# Altium schematic sheet C210_0001_Serial_Interface.SchDoc: C210_0001_Serial_Interface
size B; Date: 2/26/2021; CompanyName: U-blox; DrawnBy: EMOO; Engineer: EMOO; Organization: U-blox; Address1: 2601 25th St. SE; Address2: Salem, OR 97302; SheetNumber: 1; SheetTotal: 7; Website: www.u-blox.com; SheetSize: B; SheetTitle: C-210 Serial Interface
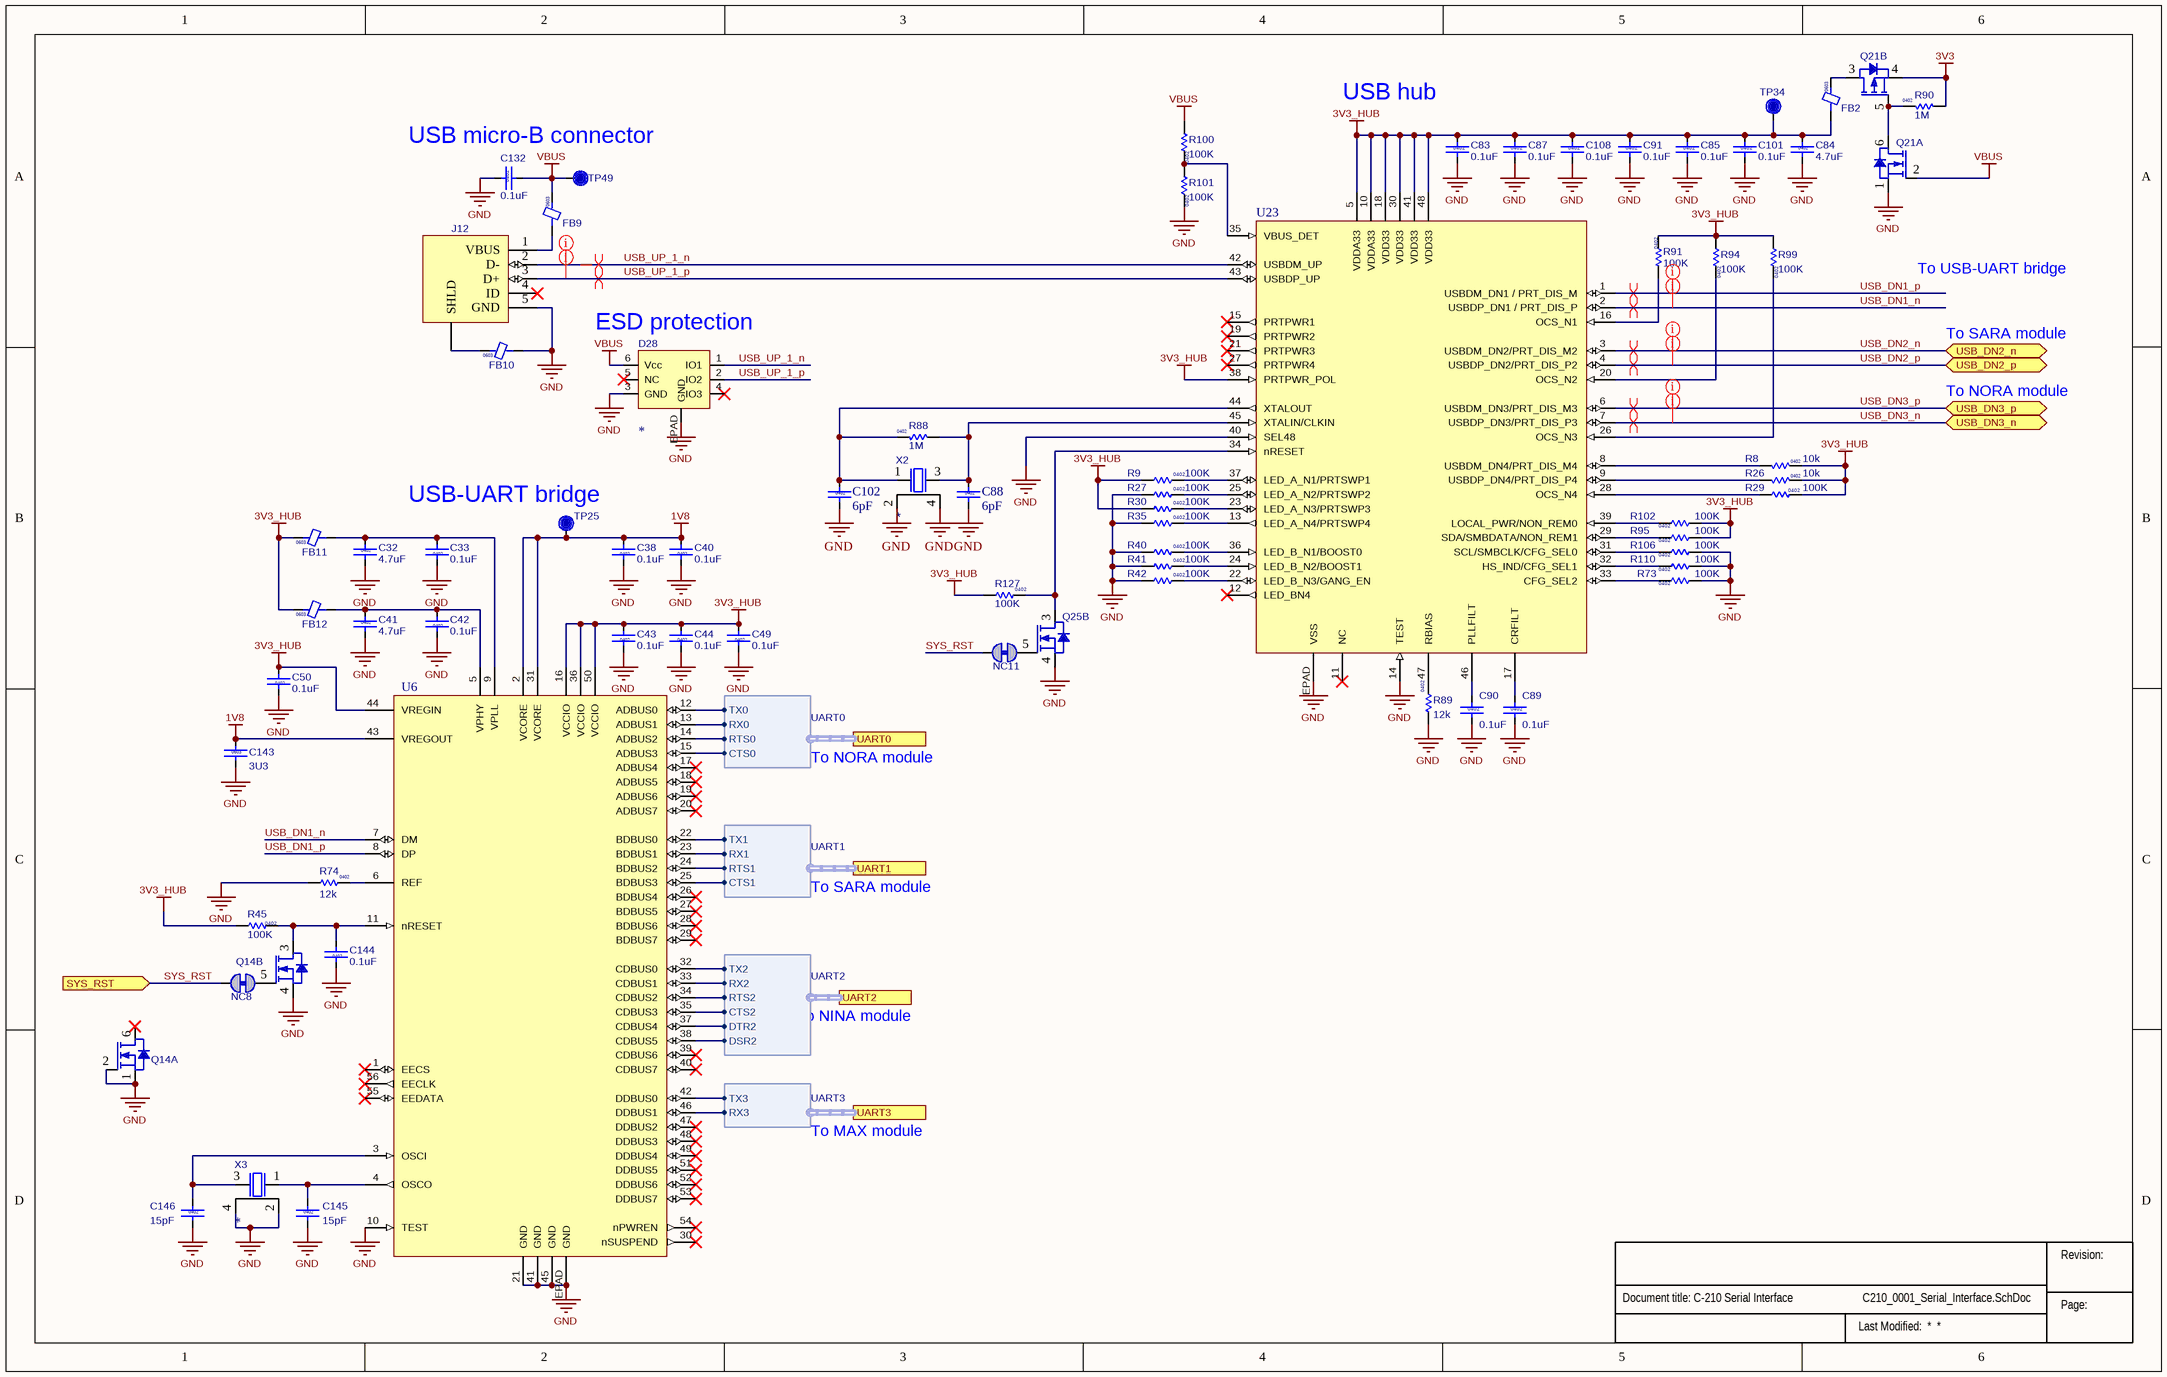
[diagram p0: C210_0001_Serial_Interface.SchDoc]

## Parts
?  (no value)  (graphical)
C32  value 4.7uF  Size: 0402  [Cap 0402 HD]
C33  value 0.1uF  Size: 0402  [Cap 0402 HD]  (hidden comment: 120-000160.1uF)
C38  value 0.1uF  Size: 0402  [Cap 0402 HD]  (hidden comment: 120-000160.1uF)
C40  value 0.1uF  Size: 0402  [Cap 0402 HD]  (hidden comment: 120-000160.1uF)
C41  value 4.7uF  Size: 0402  [Cap 0402 HD]
C42  value 0.1uF  Size: 0402  [Cap 0402 HD]  (hidden comment: 120-000160.1uF)
C43  value 0.1uF  Size: 0402  [Cap 0402 HD]  (hidden comment: 120-000160.1uF)
C44  value 0.1uF  Size: 0402  [Cap 0402 HD]  (hidden comment: 120-000160.1uF)
C49  value 0.1uF  Size: 0402  [Cap 0402 HD]  (hidden comment: 120-000160.1uF)
C50  value 0.1uF  Size: 0402  [Cap 0402 HD]  (hidden comment: 120-000160.1uF)
C83  value 0.1uF  Size: 0402  [Cap 0402 HD]  (hidden comment: 120-000160.1uF)
C84  value 4.7uF  Size: 0402  [Cap 0402 HD]
C85  value 0.1uF  Size: 0402  [Cap 0402 HD]  (hidden comment: 120-000160.1uF)
C87  value 0.1uF  Size: 0402  [Cap 0402 HD]  (hidden comment: 120-000160.1uF)
C88  value 6pF  Size: 0402  [Cap 0402 HD]
C89  value 0.1uF  Size: 0402  [Cap 0402 HD]  (hidden comment: 120-000160.1uF)
C90  value 0.1uF  Size: 0402  [Cap 0402 HD]  (hidden comment: 120-000160.1uF)
C91  value 0.1uF  Size: 0402  [Cap 0402 HD]  (hidden comment: 120-000160.1uF)
C101  value 0.1uF  Size: 0402  [Cap 0402 HD]  (hidden comment: 120-000160.1uF)
C102  value 6pF  Size: 0402  [Cap 0402 HD]
C108  value 0.1uF  Size: 0402  [Cap 0402 HD]  (hidden comment: 120-000160.1uF)
C132  value 0.1uF  Size: 0402  [Cap 0402 HD]  (hidden comment: 120-000160.1uF)
C143  value 3U3  Size: 0603  [Cap 0603 HD]
C144  value 0.1uF  Size: 0402  [Cap 0402 HD]  (hidden comment: 120-000160.1uF)
C145  value 15pF  Size: 0402  [Cap 0402 HD]
C146  value 15pF  Size: 0402  [Cap 0402 HD]
D28  (no value)  [TPD3E001DRSR]
FB2  Size: 0603  [BLM18EG221SN1]
FB9  Size: 0603  [BLM18EG221SN1]
FB10  Size: 0603  [BLM18EG221SN1]
FB11  Size: 0603  [BLM18EG221SN1]
FB12  Size: 0603  [BLM18EG221SN1]
J12  (no value)  [USB_Micro_RA_W-2TABS]
NC8  Solderbridge-ShortDNP  [Solderbridge-Short]  (value not drawn)  (net tie, no BOM)
NC11  Solderbridge-ShortDNP  [Solderbridge-Short]  (value not drawn)  (net tie, no BOM)
Q14  (no value)  [SOT-563]  (parts A,B of 2)
Q21  (no value)  [SOT-563]  (parts A,B of 2)
Q25  (no value)  [SOT-563]  (part B of 2)
R8  value 10k  Size: 0402  [RES 0402 HD]
R9  value 100K  Size: 0402  [RES 0402 HD]
R26  value 10k  Size: 0402  [RES 0402 HD]
R27  value 100K  Size: 0402  [RES 0402 HD]
R29  value 100K  Size: 0402  [RES 0402 HD]
R30  value 100K  Size: 0402  [RES 0402 HD]
R35  value 100K  Size: 0402  [RES 0402 HD]
R40  value 100K  Size: 0402  [RES 0402 HD]
R41  value 100K  Size: 0402  [RES 0402 HD]
R42  value 100K  Size: 0402  [RES 0402 HD]
R45  value 100K  Size: 0402  [RES 0402 HD]
R73  value 100K  Size: 0402  [RES 0402 HD]
R74  value 12k  Size: 0402  [RES 0402 HD]
R88  value 1M  Size: 0402  [RES 0402 HD]
R89  value 12k  Size: 0402  [RES 0402 HD]
R90  value 1M  Size: 0402  [RES 0402 HD]
R91  value 100K  Size: 0402  [RES 0402 HD]
R94  value 100K  Size: 0402  [RES 0402 HD]
R95  value 100K  Size: 0402  [RES 0402 HD]
R99  value 100K  Size: 0402  [RES 0402 HD]
R100  value 100K  Size: 0402  [RES 0402 HD]
R101  value 100K  Size: 0402  [RES 0402 HD]
R102  value 100K  Size: 0402  [RES 0402 HD]
R106  value 100K  Size: 0402  [RES 0402 HD]
R110  value 100K  Size: 0402  [RES 0402 HD]
R127  value 100K  Size: 0402  [RES 0402 HD]
TP25  TP  [TP12R]  (value not drawn)  (no BOM)
TP34  TP  [TP12R]  (value not drawn)  (no BOM)
TP49  TP  [TP12R]  (value not drawn)  (no BOM)
U6  (no value)  [QFN0.5P8.0x8.0-56Pin_EPAD]
U23  (no value)  [QFN0.5P7.0x7.0-48Pin_EPAD]
X2  (no value)  [XTAL_2520_HD]
X3  (no value)  [XTAL_2520]

## Ports
SYS_RST (in), UART0 (harness UART0), UART1 (harness UART1), UART2 (harness UART2), UART3 (harness UART3), USB_DN2_n (bidir), USB_DN2_p (bidir), USB_DN3_n (bidir), USB_DN3_p (bidir)

## Harnesses
UART0: TX0, RX0, RTS0, CTS0
UART1: TX1, RX1, RTS1, CTS1
UART2: TX2, RX2, RTS2, CTS2, DTR2, DSR2
UART3: TX3, RX3

## Nets
1V8: C38.2 C40.2 C143.1 TP25.1 U6.2(VCORE) U6.31(VCORE) U6.43(VREGOUT)
3V3: Q21.4(S2) R90.1
3V3_HUB: C43.2 C44.2 C49.2 C50.2 C83.1 C84.1 C85.1 C87.1 C91.1 C101.1 C108.1 FB2.1 FB11.2 FB12.2 R8.2 R9.1 R26.2 R29.2 R30.1 R45.1 R91.2 R94.1 R95.1 R99.1 R102.1 R127.1 TP34.1 U6.16(VCCIO) U6.36(VCCIO) U6.44(VREGIN) U6.50(VCCIO) U23.5(VDDA33) U23.10(VDDA33) U23.18(VDD33) U23.30(VDD33) U23.38(PRTPWR_POL) U23.41(VDD33) U23.48(VDD33)
GND: C32.2 C33.1 C38.1 C40.1 C41.2 C42.1 C43.1 C44.1 C49.1 C50.1 C83.2 C84.2 C85.2 C87.2 C88.2 C89.2 C90.2 C91.2 C101.2 C102.2 C108.2 C132.1 C143.2 C144.1 C145.2 C146.2 D28.3(GND) D28.EPAD(GND) FB10.1 J12.5(GND) Q14.1(S1) Q14.2(G1) Q14.4(S2) Q21.1(S1) Q25.4(S2) R27.1 R35.1 R40.1 R41.1 R42.1 R73.2 R74.1 R89.1 R101.2 R106.2 R110.2 U6.10(TEST) U6.21(GND) U6.41(GND) U6.45(GND) U6.EPAD(GND) U23.14(TEST) U23.40(SEL48) U23.EPAD(VSS) X2.2 X2.4 X3.2 X3.4
VBUS: C132.2 D28.6(Vcc) FB9.2 Q21.2(G1) R100.1 TP49.1
SYS_RST: NC8.2 NC11.2 ; port SYS_RST
USB_DN1_n: U6.7(DM) U23.2(USBDP_DN1_/_PRT_DIS_P)
USB_DN1_p: U6.8(DP) U23.1(USBDM_DN1_/_PRT_DIS_M)
USB_DN2_n: U23.3(USBDM_DN2/PRT_DIS_M2) ; port USB_DN2_n
USB_DN2_p: U23.4(USBDP_DN2/PRT_DIS_P2) ; port USB_DN2_p
USB_DN3_n: U23.7(USBDP_DN3/PRT_DIS_P3) ; port USB_DN3_n
USB_DN3_p: U23.6(USBDM_DN3/PRT_DIS_M3) ; port USB_DN3_p
USB_UP_1_n: D28.1(IO1) J12.2(D-) U23.42(USBDM_UP)
USB_UP_1_p: D28.2(IO2) J12.3(D+) U23.43(USBDP_UP)
NetC32_1: C32.1 C33.2 FB11.1 U6.9(VPLL)
NetC41_1: C41.1 C42.2 FB12.1 U6.5(VPHY)
NetC88_1: C88.1 R88.1 U23.45(XTALIN/CLKIN) X2.3
NetC89_1: C89.1 U23.17(CRFILT)
NetC90_1: C90.1 U23.46(PLLFILT)
NetC102_1: C102.1 R88.2 U23.44(XTALOUT) X2.1
NetC144_2: C144.2 Q14.3(D2) R45.2 U6.11(nRESET)
NetC145_1: C145.1 U6.4(OSCO) X3.1
NetC146_1: C146.1 U6.3(OSCI) X3.3
NetFB2_2: FB2.2 Q21.3(D2)
NetFB9_1: FB9.1 J12.1(VBUS)
NetFB10_2: FB10.2 J12.6(SHLD)
NetNC8_1: NC8.1 Q14.5(G2)
NetNC11_1: NC11.1 Q25.5(G2)
NetQ21_5: Q21.5(G2) Q21.6(D1) R90.2
NetQ25_3: Q25.3(D2) R127.2 U23.34(nRESET)
NetR8_1: R8.1 U23.8(USBDM_DN4/PRT_DIS_M4)
NetR9_2: R9.2 U23.37(LED_A_N1/PRTSWP1)
NetR26_1: R26.1 U23.9(USBDP_DN4/PRT_DIS_P4)
NetR27_2: R27.2 U23.25(LED_A_N2/PRTSWP2)
NetR29_1: R29.1 U23.28(OCS_N4)
NetR30_2: R30.2 U23.23(LED_A_N3/PRTSWP3)
NetR35_2: R35.2 U23.13(LED_A_N4/PRTSWP4)
NetR40_2: R40.2 U23.36(LED_B_N1/BOOST0)
NetR41_2: R41.2 U23.24(LED_B_N2/BOOST1)
NetR42_2: R42.2 U23.22(LED_B_N3/GANG_EN)
NetR73_1: R73.1 U23.33(CFG_SEL2)
NetR74_2: R74.2 U6.6(REF)
NetR89_2: R89.2 U23.47(RBIAS)
NetR91_1: R91.1 U23.16(OCS_N1)
NetR94_2: R94.2 U23.20(OCS_N2)
NetR95_2: R95.2 U23.29(SDA/SMBDATA/NON_REM1)
NetR99_2: R99.2 U23.26(OCS_N3)
NetR100_2: R100.2 R101.1 U23.35(VBUS_DET)
NetR102_2: R102.2 U23.39(LOCAL_PWR/NON_REM0)
NetR106_1: R106.1 U23.31(SCL/SMBCLK/CFG_SEL0)
NetR110_1: R110.1 U23.32(HS_IND/CFG_SEL1)
NetU6_12: U6.12(ADBUS0) ; port UART0.TX0
NetU6_13: U6.13(ADBUS1) ; port UART0.RX0
NetU6_14: U6.14(ADBUS2) ; port UART0.RTS0
NetU6_15: U6.15(ADBUS3) ; port UART0.CTS0
NetU6_22: U6.22(BDBUS0) ; port UART1.TX1
NetU6_23: U6.23(BDBUS1) ; port UART1.RX1
NetU6_24: U6.24(BDBUS2) ; port UART1.RTS1
NetU6_25: U6.25(BDBUS3) ; port UART1.CTS1
NetU6_32: U6.32(CDBUS0) ; port UART2.TX2
NetU6_33: U6.33(CDBUS1) ; port UART2.RX2
NetU6_34: U6.34(CDBUS2) ; port UART2.RTS2
NetU6_35: U6.35(CDBUS3) ; port UART2.CTS2
NetU6_37: U6.37(CDBUS4) ; port UART2.DTR2
NetU6_38: U6.38(CDBUS5) ; port UART2.DSR2
NetU6_42: U6.42(DDBUS0) ; port UART3.TX3
NetU6_46: U6.46(DDBUS1) ; port UART3.RX3

Not connected (* = marked no-connect by the designer): D28 4(IO3)* 5(NC)*; J12 4(ID)*; Q14 6(D1)*; U6 1(EECS)* 17(ADBUS4)* 18(ADBUS5)* 19(ADBUS6)* 20(ADBUS7)* 26(BDBUS4)* 27(BDBUS5)* 28(BDBUS6)* 29(BDBUS7)* 30(nSUSPEND)* 39(CDBUS6)* 40(CDBUS7)* 47(DDBUS2)* 48(DDBUS3)* 49(DDBUS4)* 51(DDBUS5)* 52(DDBUS6)* 53(DDBUS7)* 54(nPWREN)* 55(EEDATA)* 56(EECLK)*; U23 11(NC)* 12(LED_BN4)* 15(PRTPWR1)* 19(PRTPWR2)* 21(PRTPWR3)* 27(PRTPWR4)*

## Layout directives
differential pair; net class USB_DIFF: USB_DN1_n, USB_DN1_p, USB_DN2_n, USB_DN2_p, USB_DN3_n, USB_DN3_p, USB_UP_1_n, USB_UP_1_p
net class USB: USB_DN1_n, USB_DN1_p, USB_DN2_n, USB_DN2_p, USB_DN3_n, USB_DN3_p, USB_UP_1_n, USB_UP_1_p

## Notes on the sheet
- (near C83) USB hub
- USB micro-B connector
- To USB-UART bridge
- (near D28) ESD protection
- To NORA module
- To SARA module
- (near TP25) USB-UART bridge
- To NINA module
- To MAX module
- Revision:
- Page:

## Library data of the parts
? = Sub_Title_Block: Minimized schematic title block for all subset sheets
C32 C41 C84 = 120-00020: Cap, Ceramic 4.7uF 10V 20% X5R 0402; Manufacturer 1: Samsung Electro-Mechanics America, Inc; Manufacturer Part Number 1: CL05A475MP5NRNC; Part Name: CAP CER 4.7uF 10V 20% X5R 0402; Item Phase: In Production; Tolerance: +/- 20%; Use in new designs: Yes; UBX Code: None; Part Number: 120-00020; Supplier 1: Digi-Key; Supplier Part Number 1: 1276-1482-1-ND; Manufacturer 2: Yageo; Manufacturer Part Number 2: CC0402KRX5R6BB475; Supplier 2: Digi-Key; Supplier Part Number 2: 311-3477-1-ND; Height: 0.55mm; Max Operating Temp: 85; Min Operating Temp: -55; Pins: 2; Revision: 0C; Temperature Coefficient: X5R; Voltage: 10V
C33 C38 C40 C42-C44 C49 C50 C83 C85 C87 C89-C91 C101 C108 C132 C144 = 120-00016: Cap, Ceramic 0.1uF 10V 10% X5R 0402; Part Name: CAP CER 0.1UF 10V 10% X5R 0402; Part_Type: Ceramic Capacitor; Manufacturer: Murata Electronics North America; Manufacturer P/N: GRM155R61A104KA01J; Item_Phase: Production; Component Mounting Type: SMT; Tolerance: +/- 10%; Use in new designs: Yes; Part Number: 120-00016; Revision: 0A; Supplier 1: Digi-Key; Supplier Part Number 1: 490-6297-1-ND; Manufacturer 2: Yageo; Manufacturer P/N 2: CC0402KRX5R6BB104; Supplier 2: Digi-Key; Supplier Part Number 2: 311-1336-1-ND; Arena Link: https://app.bom.com/a/GYHPV2L2L43KRMBK?v=spec.summary; Height: 0.55mm; Pins: 2; Temperature Coefficient: X5R; Voltage: 10V
C88 C102 = 120-00048: Cap, Ceramic 6pF 50V NP0 0402  Tolerance = +/-0.5pF; Manufacturer 1: Cal-Chip Electronics; Manufacturer Part Number 1: GMC04CG6R0D50NT; Part Name: CAP CER 6pF 50V +/-0.5pF NP0 0402; Item Phase: In Production; Tolerance: Other; Use in new designs: Yes; UBX Code: None; Part Number: 120-00048; Supplier 1: None; Supplier Part Number 1: None; Manufacturer 2: Darfon Electronics Corp; Manufacturer Part Number 2: C1005NPO609DGTS; Supplier 2: None; Supplier Part Number 2: None; Height: 0.55mm; Max Operating Temp: 125; Min Operating Temp: -55; Pins: 2; Revision: 0B; Temperature Coefficient: NP0; Voltage: 50V
C143 = UBXH01-0000035: CAP CER X5R 0603 3U3 10% 10V; Manufacturer: Murata Manufacturing Company, Ltd.; Manufacturer P/N: GRM188R61A335KE15; Editor: dario.antonaz; Released by: karel.cotic; Env: ROHS; Permitted Use: Volume Products; Perferred: PREF; Mfg P/N Status: NRND; Mfg P/N Split: 100; Mfg P/N Released: Yes; Part Number: UBXH01-0000035; Tolerance: 10%; Max Voltage: 10V; Part Type: Capacitor; Release Data: 2011-07-12T16:43:12; UBX Wiki: https://wiki.u-blox.com/bin/view/Operations/PartDetails?index=15220; RefDes: C; Mfg P/N Datasheet: https://wiki.u-blox.com/bin/view/Generic/Docs/DocumentSummary?index=15218; Manufacturer 2: Samsung Electro-Mechanics; Manufacturer P/N 2: CL10A335KP8NNN; Mfg P/N Status 2: Active; Mfg P/N Split 2: 0; Mfg P/N Released 2: Yes; Mfg P/N Datasheet 2: https://wiki.u-blox.com/bin/view/Generic/Docs/DocumentSummary?index=28127
C145 C146 = 120-00110: Capacitor, Ceramic, 15pF 5%, 50V, NPO, 0402; Manufacturer 1: Murata Electronics North America; Manufacturer Part Number 1: GRM1555C1H150JA01D; Part Name: CAP CER 15pF 50V 5% NP0 0402; Item Phase: In Production; Temperature Coefficient: NP0; Tolerance: +/- 5%; Use in new designs: Yes; UBX Code: None; Part Number: 120-00110; Supplier 1: Digi-Key; Supplier Part Number 1: 490-5888-1-ND; Manufacturer 2: None; Manufacturer Part Number 2: None; Supplier 2: None; Supplier Part Number 2: None; Height: 0.55mm; Max Operating Temp: 125; Min Operating Temp: -55; Pins: 2; Revision: 0A; Voltage: 50V
D28 = TPD3E001: TVS Diode, ESD High Speed 3-Channel Array, WSON-6, 3mmX3mm; Manufacturer 1: Texas Instruments; Part Name: Diode TVS 5V 3CH WSON-6; Current: None; Item Phase: In Production; MFG Package: WSON-6, DRS (S-PWSON-N6); Use in new designs: Yes; Voltage: 5.5V; Manufacturer Part Number 1: TPD3E001DRSR; Manufacturer 2: None; Manufacturer Part Number 2: None; Supplier 2: None; Supplier Part Number 2: None; Body Size: 3mm x 3mm; Height: 0.80mm; Max Operating Temp: 85; Min Operating Temp: -40; Pins: 6; Revision: 0A; UBX Code: None; Manufacturer P/N: *
FB2 FB9-FB12 = BLM18EG221SN1: Ferrite Bead, 220ohm @ 100MHz, 2A, 0603; Manufacturer 1: Murata Electronics North America; Manufacturer Part Number 1: BLM18EG221SN1D; Part Name: Ferrite Bead 220ohm 2A 0503; Body Size: None; Item Phase: Unreleased; Use in new designs: Yes; Value: None; Part Number: BLM18EG221SN1; Supplier 1: Digi-Key; Supplier Part Number 1: 490-3992-2-ND; Current: 2A; Height: 0.8mm; MFG Package: None; Max Operating Temp: 85; Min Operating Temp: -55; Pins: None; Revision: None; Voltage: None; Manufacturer 2: None; Manufacturer Part Number 2: None; Supplier 2: None; Supplier Part Number 2: None; UBX Code: None
J12 = 130-00008: USB Micro B Receptacle, Right Angle SMT with 2 TH Tabs, 0.65mm; Part Name: CON USB Micro-B SMT RA 2 Tabs; Part_Type: Connector; Manufacturer: FCI; Manufacturer P/N: 10118193-0001LF; Item_Phase: Production; Keyed: Yes; Locking: No; Rows: 1; Part Number: 130-00008; Revision: 0B; Supplier 1: Digi-Key; Supplier Part Number 1: 609-4616-1-ND; Manufacturer 2: Seeed Technology; Manufacturer P/N 2: Rigado 130-00008; Supplier 2: Seeed Technology; Supplier Part Number 2: Rigado 130-00008; Arena Link: https://app.bom.com/a/O6PX3ATATCBTBM9U?v=spec.summary; Color: Silver; Component Mounting Type: SMT; Connector Type: USB; Height: 3.10mm; Length: 5.05mm; Pin Pitch: 0.65mm; Pins: 5; Use in new designs: Yes; Width: 7.86mm
NC8 NC11 = Solderbridge-Short: Added By: Paul B; Part Number: Solderbridge-Short; Height: 0; DNP: DNP; Added Date: 12/2/2015
Q14 Q25 = 140-00016: MOSFET 2N-CH 20V 0.8A, SOT-563; Manufacturer 1: Toshiba Semiconductor and Storage; Manufacturer Part Number 1: SSM6N56FE,LM; Part Name: MOSFET 2N-CH 20V 0.8A SOT-563; Body Size: 1.6mm x 1.2mm; Current: 800mA; Item Phase: In Production; Transistor Type: N-Channel; Thermal Pad: No; Use in new designs: Yes; UBX Code: None; Part Number: 140-00016; Supplier 1: Digi-Key; Supplier Part Number 1: SSM6N56FELMCT-ND; Height: 0.6mm; MFG Package: SOT-563; Max Operating Temp: 150; Min Operating Temp: -55; Pins: 6; Revision: 0A; Voltage: 20V; Manufacturer 2: None; Manufacturer Part Number 2: None; Supplier 2: None; Supplier Part Number 2: None
Q21 = 140-00030: MOSFET N/P-CH 20V SOT-563, 540 mA, −430 mA; Manufacturer 1: ON Semiconductor; Manufacturer Part Number 1: NTZD3155CT2G; Body Size: 1.6mmx1.6mm; Item Phase: In Production; Transistor Type: Multiple; Thermal Pad: No; Use in new designs: Yes; UBX Code: None; Part Number: 140-00030; Supplier 1: Digi-Key; Supplier Part Number 1: NTZD3155CT2GOSCT-ND; Current: 540 mA, −430 mA; Height: 0.6mm; MFG Package: SOT-563; Max Operating Temp: 150; Min Operating Temp: -55; Part Name: MOSFET N/P-CH 20V SOT-563; Pins: 6; Revision: 0A; Voltage: 20V; Manufacturer 2: None; Manufacturer Part Number 2: None; Supplier 2: None; Supplier Part Number 2: None
R8 R26 = 180-00024: Resistor 10k ohm 1% 1/16W, 0402; Manufacturer 1: Samsung Electro-Mechanics America, Inc; Manufacturer Part Number 1: RC1005F103CS; Part Name: RES SMD 10K OHM 1% 1/16W 0402; Item Phase: In Production; Tolerance: +/- 1%; Use in new designs: Yes; UBX Code: None; Part Number: 180-00024; Supplier 1: Digi-Key; Supplier Part Number 1: 1276-3431-1-ND; Manufacturer 2: Hong Kong Resistors Manufactory; Manufacturer Part Number 2: RCT0210KFLF; Supplier 2: None; Supplier Part Number 2: None; Height: 0.4mm; Max Operating Temp: 155; Min Operating Temp: -55; Pins: 2; Power: 1/16W; Revision: 0E; Voltage: N/A
R9 R27 R29 R30 R35 R40-R42 R45 R73 R91 R94 R95 R99-R102 R106 R110 R127 = 180-00093: Resistor 100K ohm 1% 1/16W, 0402; Manufacturer 1: Yageo; Manufacturer Part Number 1: RC0402FR-07100KL; Part Name: RES SMD 100K ohm 1% 1/16W 0402; Item Phase: In Production; Tolerance: +/- 1%; Use in new designs: Yes; Voltage: None; Part Number: 180-00093; Supplier 1: Digi-Key; Supplier Part Number 1: 311-100KLRCT-ND; Manufacturer 2: Rohm Semiconductor; Manufacturer Part Number 2: MCR01MRTF1003; Supplier 2: Digi-Key; Supplier Part Number 2: RHM100KCDCT-ND; Height: 0.4mm; Max Operating Temp: 155; Min Operating Temp: -55; Pins: 2; Power: 1/16W; Revision: 0B; UBX Code: None
R74 R89 = 180-00096: Resistor 12k ohm 1% 1/16W 0402; Manufacturer 1: None; Part Name: RES SMD 12K OHM 1% 1/16W 0402; Item Phase: In Production; Tolerance: +/- 1%; Use in new designs: Yes; Part Number: 180-00096; Manufacturer Part Number 1: None; Supplier 1: Digi-Key; Supplier Part Number 1: 1276-4122-1-ND; Manufacturer 2: Yageo; Manufacturer Part Number 2: RC0402FR-0712KL; Supplier 2: Digi-Key; Supplier Part Number 2: 311-12.0KLRCT-ND; Height: 0.4mm; Max Operating Temp: 155; Min Operating Temp: -55; Pins: 2; Power: 1/16W; Revision: 0A; Voltage: None; UBX Code: None
R88 R90 = 180-00054: Resistor 1M ohm 1%, 1/16W, 0402; Manufacturer 1: Samsung Electro-Mechanics America, Inc; Manufacturer Part Number 1: RC1005F105CS; Part Name: RES SMD 1M OHM 1% 1/16W 0402; Item Phase: In Production; Tolerance: +/- 1%; Use in new designs: Yes; Voltage: None; Part Number: 180-00054; Supplier 1: Digi-Key; Supplier Part Number 1: 1276-3433-1-ND; Manufacturer 2: Hong Kong Resistors Manufactory; Manufacturer Part Number 2: RCT021MFLF; Supplier 2: None; Supplier Part Number 2: None; Height: 0.4mm; Max Operating Temp: 155; Min Operating Temp: -55; Pins: 2; Power: 1/16W; Revision: 0D; UBX Code: None
TP25 TP34 TP49 = TP_R: Testpoint, Round 1.0mm Dia; Part Number: TP10R; Added By: Jeremy D; Size: 1.0mm; Height: 0; DNP: DNP; Added Date: 2/1/2015; Checked By: Paul B; Checked Date: 2/5/2015
U6 = FT4232H: IC, SMT, UART/SERIAL BRIDGE, QUAD, USB 2.0, FULL HANDSHAKE, 12MBps, 2.97-3.63V, 8mmx8mm QFN56; Manufacturer 1: FTDI; Body Size: 8.0mm x 8.0mm; Item Phase: Unreleased; MFG Package: QFN-56; SMT Pitch: 0.5mm; Use in new designs: Yes; UBX Code: None; Manufacturer Part Number 1: FT4232H; Height: 0.9mm; Max Operating Temp: 85; Min Operating Temp: -40; Pins: 56; Revision: None; Size: Other; Voltage: 2.97-3.63V; Manufacturer 2: None; Manufacturer Part Number 2: None; Supplier 2: None; Supplier Part Number 2: None
U23 = USB2514-HZH: 4-PORT USB 2.0 HUB CTRLR, QFN-48, 7.0mmx7.0mm; Manufacturer 1: SMSC; Current: None; Item Phase: In Production; Use in new designs: Yes; Part Number: USB2514-HZH; Manufacturer Part Number 1: USB2514-HZH; Body Size: 7.0mm x 7.0mm; Height: 1.0mm; MFG Package: QFN-48; Max Operating Temp: 70; Min Operating Temp: 0; Part Name: USB2514-HZH; Pins: 48; Revision: 0A; Voltage: N/A; UBX Code: None
X2 = 100-00017: Crystal, 24.0000MHz, 20ppm, 10pF, 100 Ohm, -20Â°C - 70Â°C, SMT 4 Pin 2520; Manufacturer 1: Abracon LLC; Manufacturer Part Number 1: ABM10-24.000MHZ-E20-T; Part Name: XTAL 24MHz 10pF 20ppm 2520; Body Size: 2.5mm x 2.0mm; Item Phase: Unreleased; MFG Package: 2520; Use in new designs: Yes; Voltage: None; Value: *; Part Number: 100-00017; Supplier 1: Digi-Key; Supplier Part Number 1: 535-9093-1-ND; Manufacturer 2: Raltron Electronics; Manufacturer Part Number 2: R2520-24.000-10-1010-TR-NS4; Supplier 2: None; Supplier Part Number 2: None; Height: 0.7mm; Max Operating Temp: 70; Min Operating Temp: -20; Pins: 4; Revision: None; UBX Code: None
X3 = 100-00033: 12MHz ±10ppm Crystal 8pF 125 Ohm -40°C ~ 85°C Surface Mount 4-SMD, No Lead; Manufacturer 1: Abracon LLC; Manufacturer Part Number 1: ABM10-167-12.000MHZ-T3; Part Name: XTAL 12MHz, 8pF, 30ppm; Body Size: 2.5mm X 2.0mm; Item Phase: Unreleased; Use in new designs: Yes; Voltage: None; Value: *; Part Number: 100-00033; Supplier 1: Digi-Key; Supplier Part Number 1: 535-13521-1-ND; Manufacturer 2: None; Manufacturer Part Number 2: None; Supplier 2: None; Supplier Part Number 2: None; Height: 0.7mm; MFG Package: 4-SMD; Max Operating Temp: 85; Min Operating Temp: -40; Pins: 4; Revision: None; UBX Code: None